# EAGLE design mug_marc_plane (EAGLE 5.11)
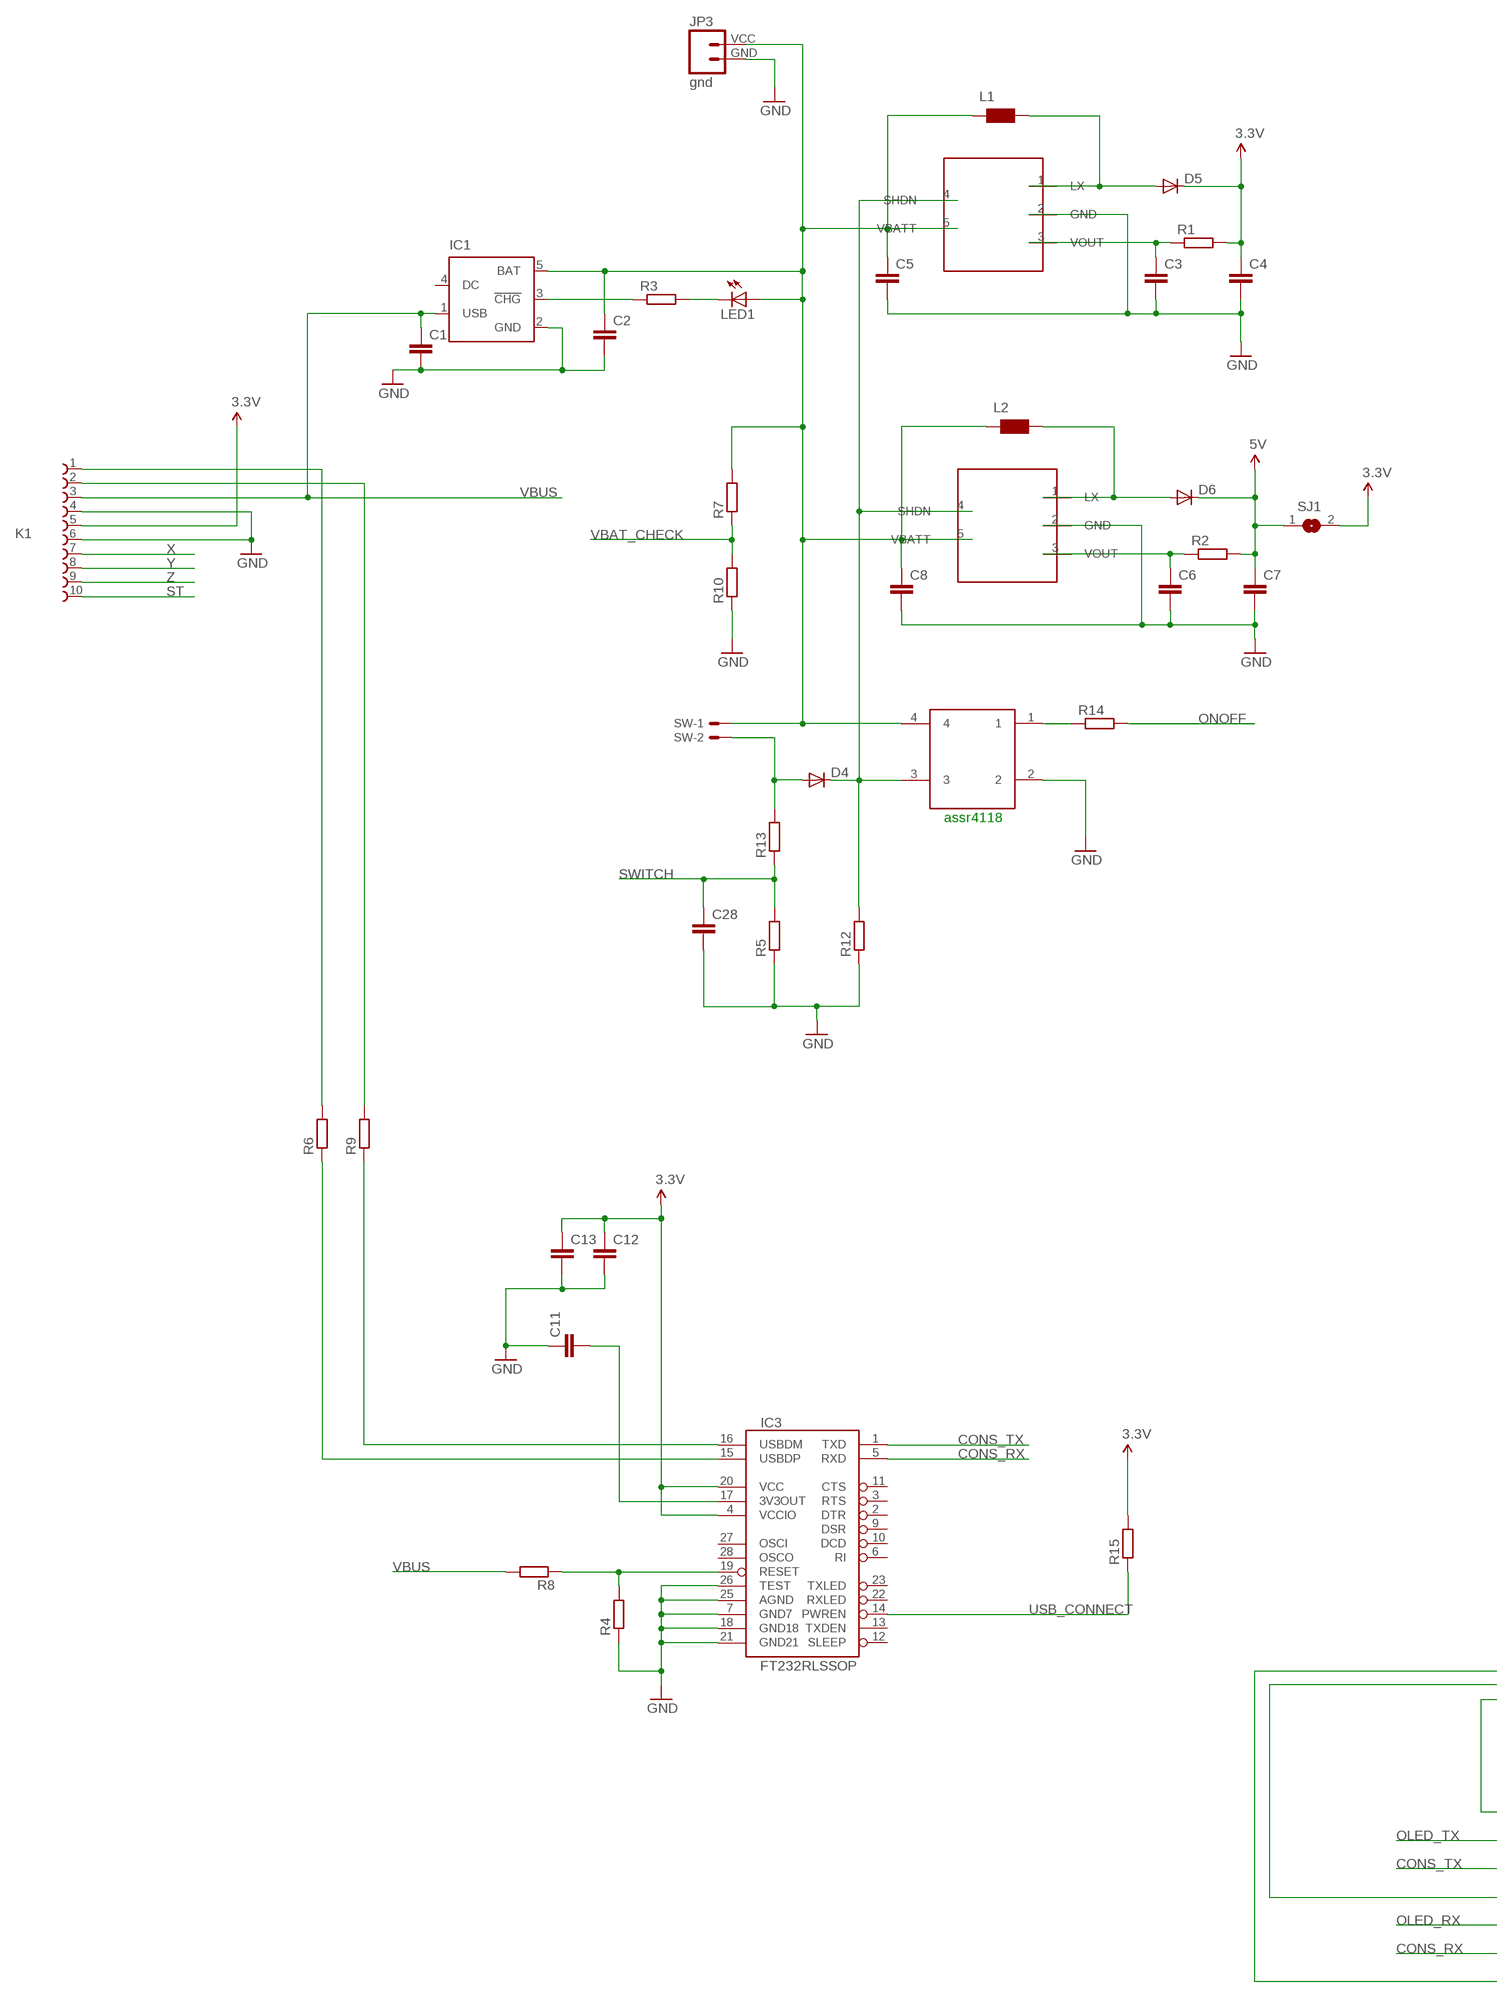
[diagram p0: schematic, sheet 1, part 1 of 2]
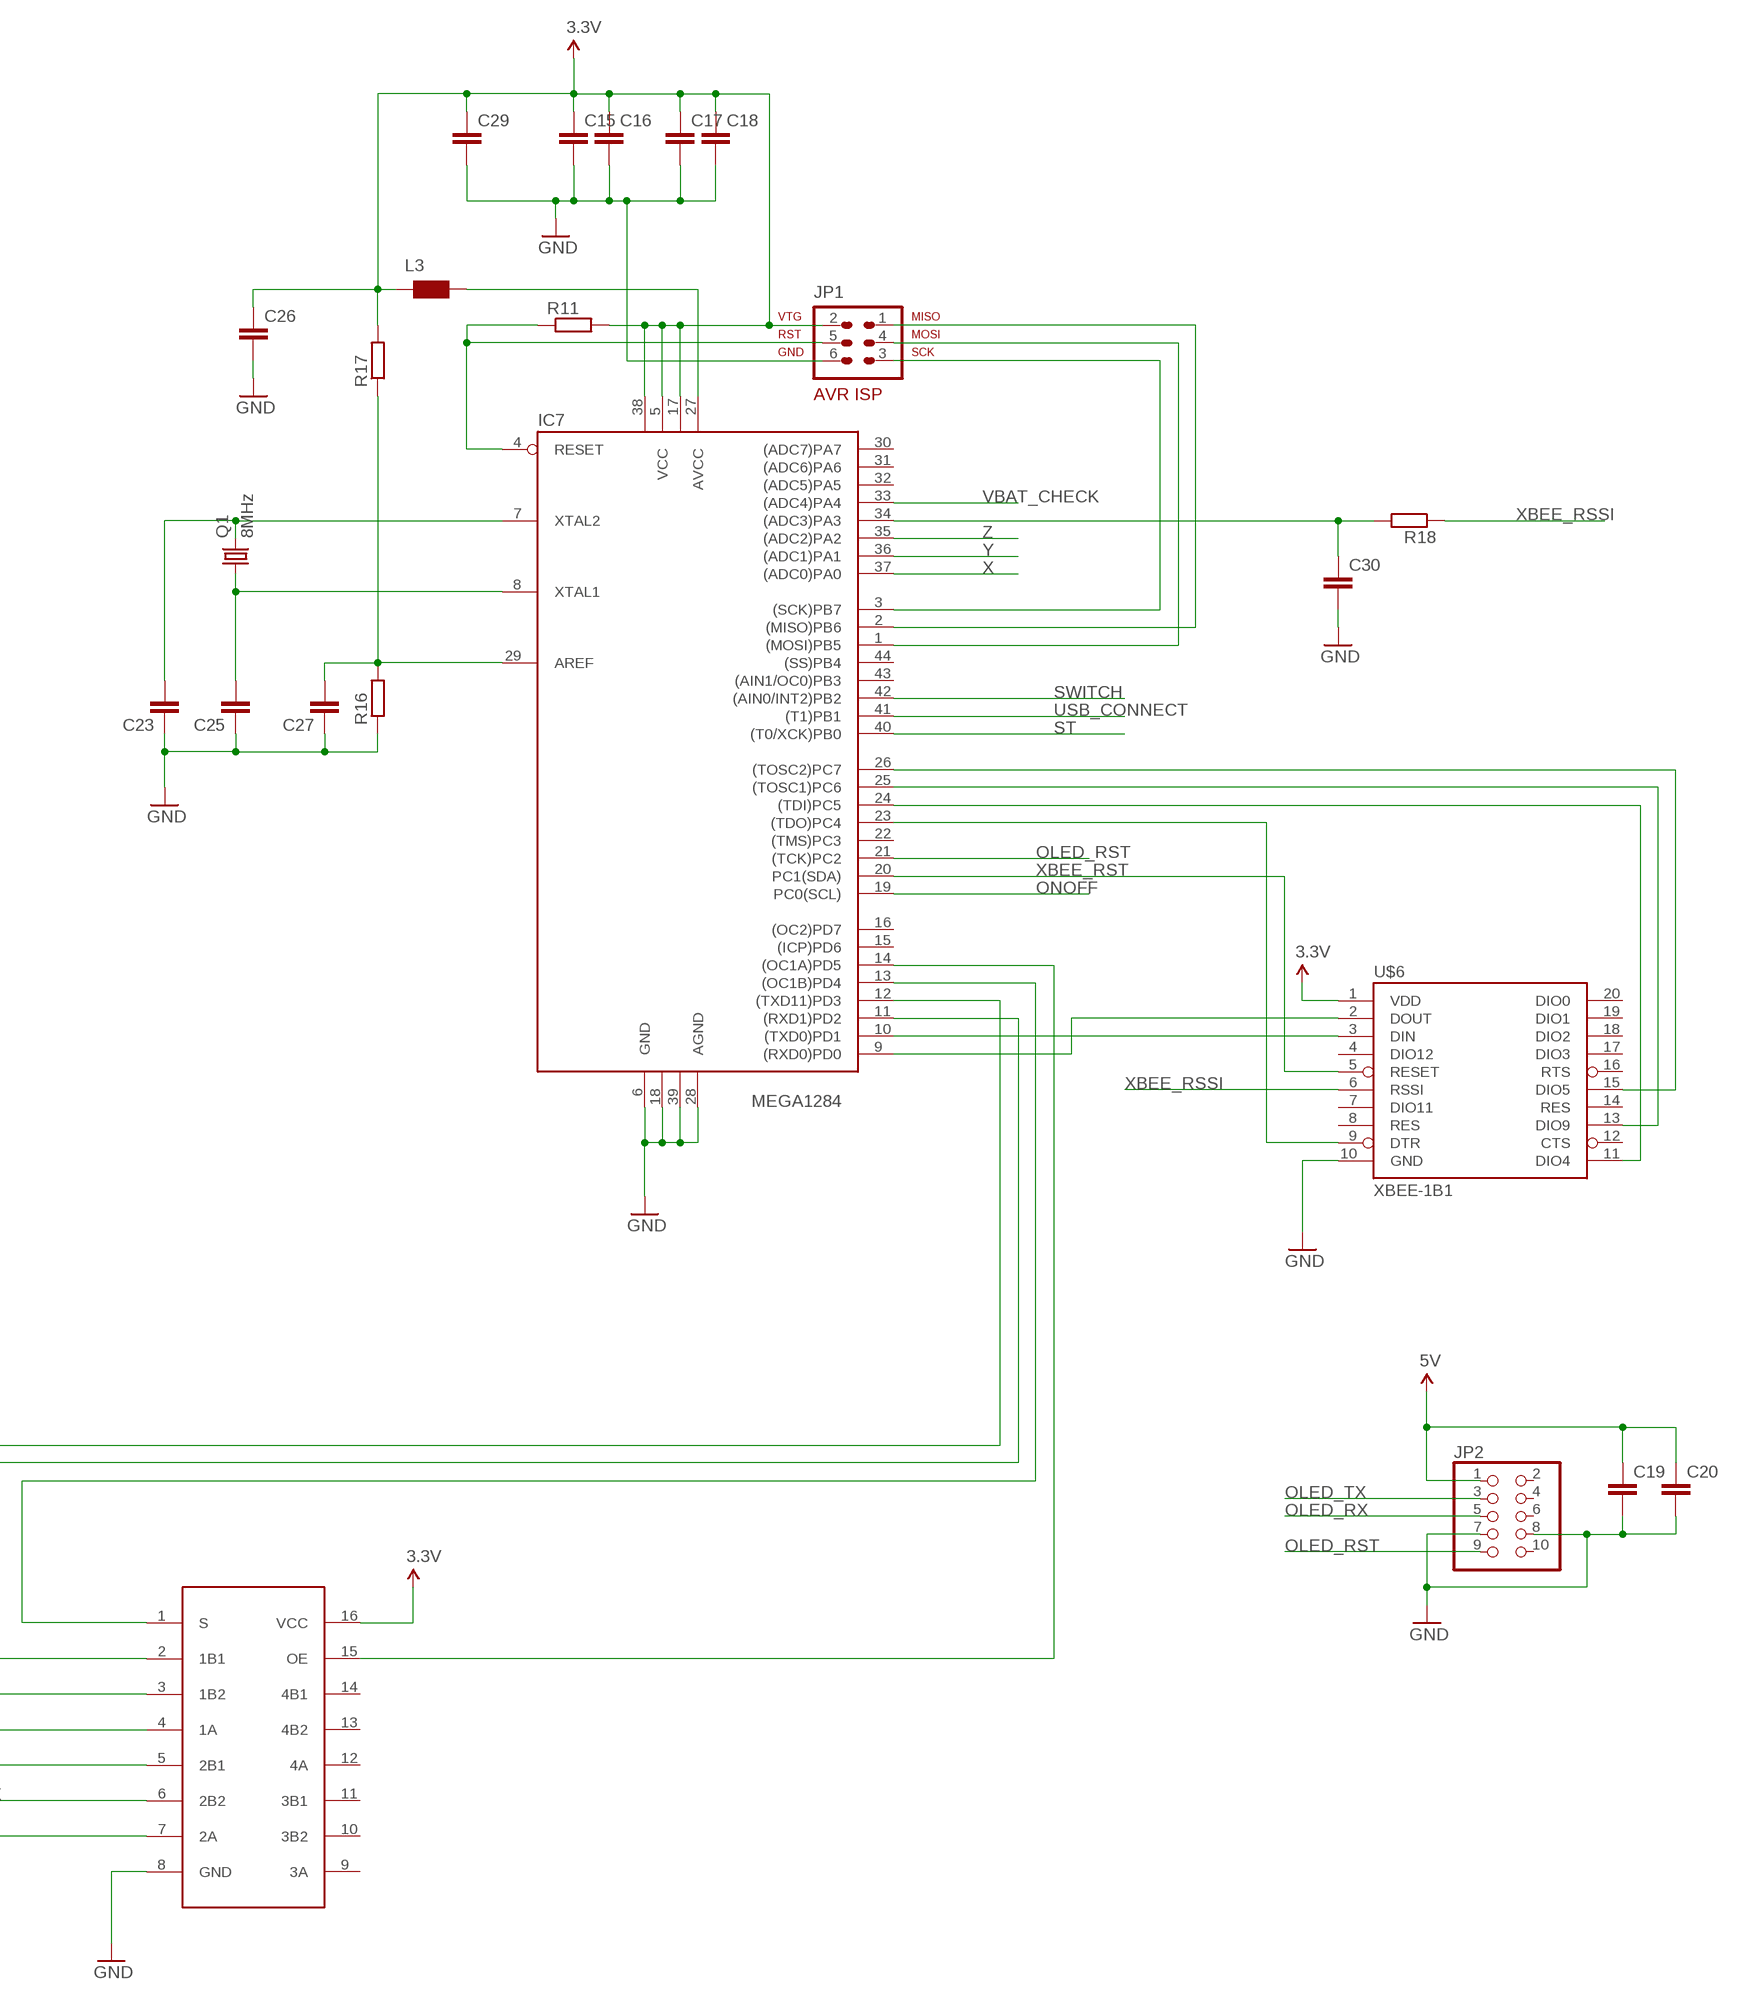
[diagram p1: schematic, sheet 1, part 2 of 2]

## Parts
C1  C-EUC0805  [C0805]
C2  C-EUC0805  [C0805]
C3  C-EUC0805  [C0805]
C4  C-EUC1210  [C1210]
C5  C-EUC1210  [C1210]
C6  C-EUC0805  [C0805]
C7  C-EUC1210  [C1210]
C8  C-EUC1210  [C1210]
C11  C-EUC0603  [C0603]
C12  C-EUC0805  [C0805]
C13  C-EUC0805  [C0805]
C15  C-EUC0805  [C0805]
C16  C-EUC0805  [C0805]
C17  C-EUC0805  [C0805]
C18  C-EUC0805  [C0805]
C19  C-EUC0805  [C0805]
C20  C-EUC0805  [C0805]
C23  C-EUC0603  [C0603]
C25  C-EUC0603  [C0603]
C26  C-EUC0805  [C0805]
C27  C-EUC0603  [C0603]
C28  C-EUC0805  [C0805]
C29  C-EUC0805  [C0805]
C30  C-EUC0805  [C0805]
D4  DIODE-DO214AC  [DO214AC]
D5  DIODE-DO214AC  [DO214AC]
D6  DIODE-DO214AC  [DO214AC]
IC1  MAX1555  [SOT23-5L]
IC3  FT232RLSSOP  [SSOP28DB]
IC4  ASSR  ASSR4118  [SO-6/4]
IC5  SP6641  [SOT23-5]
IC6  74XX3257  [SO16D]
IC7  MEGA1284  [TQFP44]
IC8  SP6641  [SOT23-5]
JP1  ISP  AVR-ISP-6  [AVR-ISP-6]
JP2  PINHD-2X5  [2X05]
JP3  gnd  M024UCON-15767  [S2B-PH-VERTICAL]
K1  68611014422  [68611014422]
L1  WE-TPC_L/LH  [WE-TPC_L/LH]
L2  WE-TPC_L/LH  [WE-TPC_L/LH]
L3  WE-TPC_L/LH  [WE-TPC_L/LH]
LED1  LED1206  [LED-1206]
Q1  8MHz  CRYSTALSMD  [HC49UP]
R1  R-EU_R0805  [R0805]
R2  R-EU_R0805  [R0805]
R3  R-EU_R0805  [R0805]
R4  R-EU_R0805  [R0805]
R5  R-EU_R0805  [R0805]
R6  R-EU_R0805  [R0805]
R7  R-EU_R0805  [R0805]
R8  R-EU_R0805  [R0805]
R9  R-EU_R0805  [R0805]
R10  R-EU_R0805  [R0805]
R11  R-EU_R0805  [R0805]
R12  R-EU_R0805  [R0805]
R13  R-EU_R0805  [R0805]
R14  R-EU_R0805  [R0805]
R15  R-EU_R0805  [R0805]
R16  R-EU_R0805  [R0805]
R17  R-EU_R0805  [R0805]
R18  R-EU_R0805  [R0805]
SJ1  SJW  [SJW]
SW  53398-02  [53398-02]
U$6  XBEE-1B1  [XBEE-1]

## Nets
5V: C7.1 C19.1 C20.1 D6.C JP2.1 R2.2 SJ1.1
CONS_RX: IC3.5(RXD) IC6.6(2B2)
CONS_TX: IC3.1(TXD) IC6.3(1B2)
GND: C1.2 C2.2 C3.2 C4.2 C5.2 C6.2 C7.2 C8.2 C11.1 C12.2 C13.2 C15.2 C16.2 C17.2 C18.2 C19.2 C20.2 C23.1 C25.1 C26.2 C27.1 C28.2 C29.2 C30.2 IC1.2(GND) IC3.7(GND7) IC3.18(GND18) IC3.21(GND21) IC3.25(AGND) IC3.26(TEST) IC4.2 IC5.2(GND) IC6.8(GND) IC7.6(GND) IC7.18(GND1) IC7.28(AGND) IC7.39(GND2) IC8.2(GND) JP1.6 JP2.7 JP2.8 JP3.GND K1.4 K1.6 R4.1 R5.1 R10.1 R12.1 R16.1 U$6.10(GND)
N$1: IC6.4(1A) IC7.11((RXD1)PD2)
N$2: LED1.C R3.2
N$3: D5.A IC5.1(LX) L1.1
N$4: IC7.4(RESET) JP1.5 R11.1
N$5: IC7.2((MISO)PB6) JP1.1
N$6: IC7.1((MOSI)PB5) JP1.4
N$7: IC7.3((SCK)PB7) JP1.3
N$9: C3.1 IC5.3(VOUT) R1.1
N$10: C2.1 C5.1 C8.1 IC1.5(BAT) IC4.4 IC5.5(VBATT) IC8.5(VBATT) JP3.VCC L1.2 L2.2 LED1.A R7.2 SW.1
N$11: D6.A IC8.1(LX) L2.1
N$12: C6.1 IC8.3(VOUT) R2.1
N$13: IC1.3(!CHG) R3.1
N$15: D4.A R13.2 SW.2
N$17: C11.2 IC3.17(3V3OUT)
N$18: IC7.9((RXD0)PD0) U$6.2(DOUT)
N$19: IC7.10((TXD0)PD1) U$6.3(DIN)
N$20: IC3.16(USBDM) R9.1
N$21: K1.2 R9.2
N$22: K1.1 R6.2
N$23: IC3.15(USBDP) R6.1
N$25: IC7.24((TDI)PC5) U$6.11(DIO4)
N$26: IC3.19(RESET) R4.2 R8.1
N$27: D4.C IC4.3 IC5.4(SHDN) IC8.4(SHDN) R12.2
N$28: C30.1 IC7.34((ADC3)PA3) R18.2
N$29: IC7.25((TOSC1)PC6) U$6.13(DIO9)
N$30: IC7.23((TDO)PC4) U$6.9(DTR)
N$31: IC7.26((TOSC2)PC7) U$6.15(DIO5)
N$33: IC4.1 R14.1
N$34: C25.2 IC7.8(XTAL1) Q1.1
N$36: IC6.7(2A) IC7.12((TXD11)PD3)
N$37: IC6.1(S) IC7.13((OC1B)PD4)
N$38: IC6.15(OE) IC7.14((OC1A)PD5)
N$39: IC7.27(AVCC) L3.1
N$40: C27.2 IC7.29(AREF) R16.2 R17.1
N$43: C23.2 IC7.7(XTAL2) Q1.2
N$45: C4.1 C12.1 C13.1 C15.1 C16.1 C17.1 C18.1 C26.1 C29.1 D5.C IC3.4(VCCIO) IC3.20(VCC) IC6.16(VCC) IC7.5(VCC) IC7.17(VCC1) IC7.38(VCC2) JP1.2 K1.5 L3.2 R1.2 R11.2 R15.2 R17.2 SJ1.2 U$6.1(VDD) ; supply symbol labelled 3.3V
OLED_RST: IC7.21((TCK)PC2) JP2.9
OLED_RX: IC6.5(2B1) JP2.5
OLED_TX: IC6.2(1B1) JP2.3
ONOFF: IC7.19(PC0(SCL)) R14.2
ST: IC7.40((T0/XCK)PB0) K1.10
SWITCH: C28.1 IC7.42((AIN0/INT2)PB2) R5.2 R13.1
USB_CONNECT: IC3.14(PWREN) IC7.41((T1)PB1) R15.1
VBAT_CHECK: IC7.33((ADC4)PA4) R7.1 R10.2
VBUS: C1.1 IC1.1(USB) K1.3 R8.2
X: IC7.37((ADC0)PA0) K1.7
XBEE_RSSI: R18.1 U$6.6(RSSI)
XBEE_RST: IC7.20(PC1(SDA)) U$6.5(RESET)
Y: IC7.36((ADC1)PA1) K1.8
Z: IC7.35((ADC2)PA2) K1.9
Unconnected: IC1.4(DC) IC3.2(DTR) IC3.3(RTS) IC3.6(RI) IC3.9(DSR) IC3.10(DCD) IC3.11(CTS) IC3.12(SLEEP) IC3.13(TXDEN) IC3.22(RXLED) IC3.23(TXLED) IC3.27(OSCI) IC3.28(OSCO) IC6.9(3A) IC6.10(3B2) IC6.11(3B1) IC6.12(4A) IC6.13(4B2) IC6.14(4B1) IC7.15((ICP)PD6) IC7.16((OC2)PD7) IC7.22((TMS)PC3) IC7.30((ADC7)PA7) IC7.31((ADC6)PA6) IC7.32((ADC5)PA5) IC7.43((AIN1/OC0)PB3) IC7.44((SS)PB4) JP2.2 JP2.4 JP2.6 JP2.10 U$6.4(DIO12) U$6.7(DIO11) U$6.8(RES) U$6.12(CTS) U$6.14(RES) U$6.16(RTS) U$6.17(DIO3) U$6.18(DIO2) U$6.19(DIO1) U$6.20(DIO0)

## Notes on the sheet
- assr4118

## Library data of the parts
C1-C8 C11-C13 C15-C20 C23 C25-C30 = rcl:C-EU: CAPACITOR, European symbol
D4-D6 = diode:DIODE-: DIODE
IC1 = maxim:MAX1555: Dual-Input USB/AC Adapter 1-Cell Li+ Battery Chargers Source: http://www.maxim-ic.com .. MAX1551-MAX1555.pdf
IC3 = SparkFun:FT232RL: USB UART FT232RL 4th Generation USB UART (USB <-> Serial) Controller. Spark Fun Electronics SKU : COM-00650
IC4 = stan_1:ASSR4118
IC5 IC8 = stan_1:SP6641
IC6 = stan_1:74XX3257
IC7 = stan_1:MEGA1284
JP1 = atmel-1:AVR-ISP-6: AVR ISP-6 Serial Programming Header
JP2 = pinhead:PINHD-2X5: PIN HEADER
JP3 = SparkFun2:M02: Header 2 Standard 2-pin 0.1" header. Use with straight break away headers (SKU : PRT-00116), right angle break away headers (PRT-00553), swiss pins (PRT-00743), machine pins (PRT-00117), and female headers (PRT-00115). Molex polarized connector foot print use with SKU : PRT-08233 with associated crimp pins and housings.
K1 = Wuerth_Elektronik_eiCan_03_ZIF_Connectors_Flat_Flexible_Cable:68611014422: WR-FPC 1.00mm SMT ZIF Horizontal Bottom Contact, 10 Pins
L1-L3 = wuerth-elektronik:WE-TPC: Shielded Tiny Power Inductor WE-TPC - Extremely flat power inductor - High current capability - High reliability and perfect soldering characteristics because of integrated soldering pad - magnetically shielded -- Portable power like PDA, digital camera, PCMICA-cards and displays -- DC/DC-converter -- Recommended for switching regulator IC's from Linear Technology, National Semiconductor, Texas Instruments and Fairchild Semiconductor
LED1 = SparkFun:LED: LEDs Standard schematic elements and footprints for 5mm, 3mm, 1206, and 0603 sized LEDs. 5mm - Spark Fun Electronics SKU : COM-00529 (and others)
Q1 = SparkFun:CRYSTAL: Crystals Various standard crystals. Proven footprints. Spark Fun Electronics SKU : COM-00534
R1-R18 = rcl:R-EU_: RESISTOR, European symbol
SJ1 = jumper:SJ: SMD solder JUMPER
SW = con-molex:53?-02: CONNECTOR wire to board 1.25 mm (.049 inch) pitch header
U$6 = SparkFun:XBEE-1

## Board
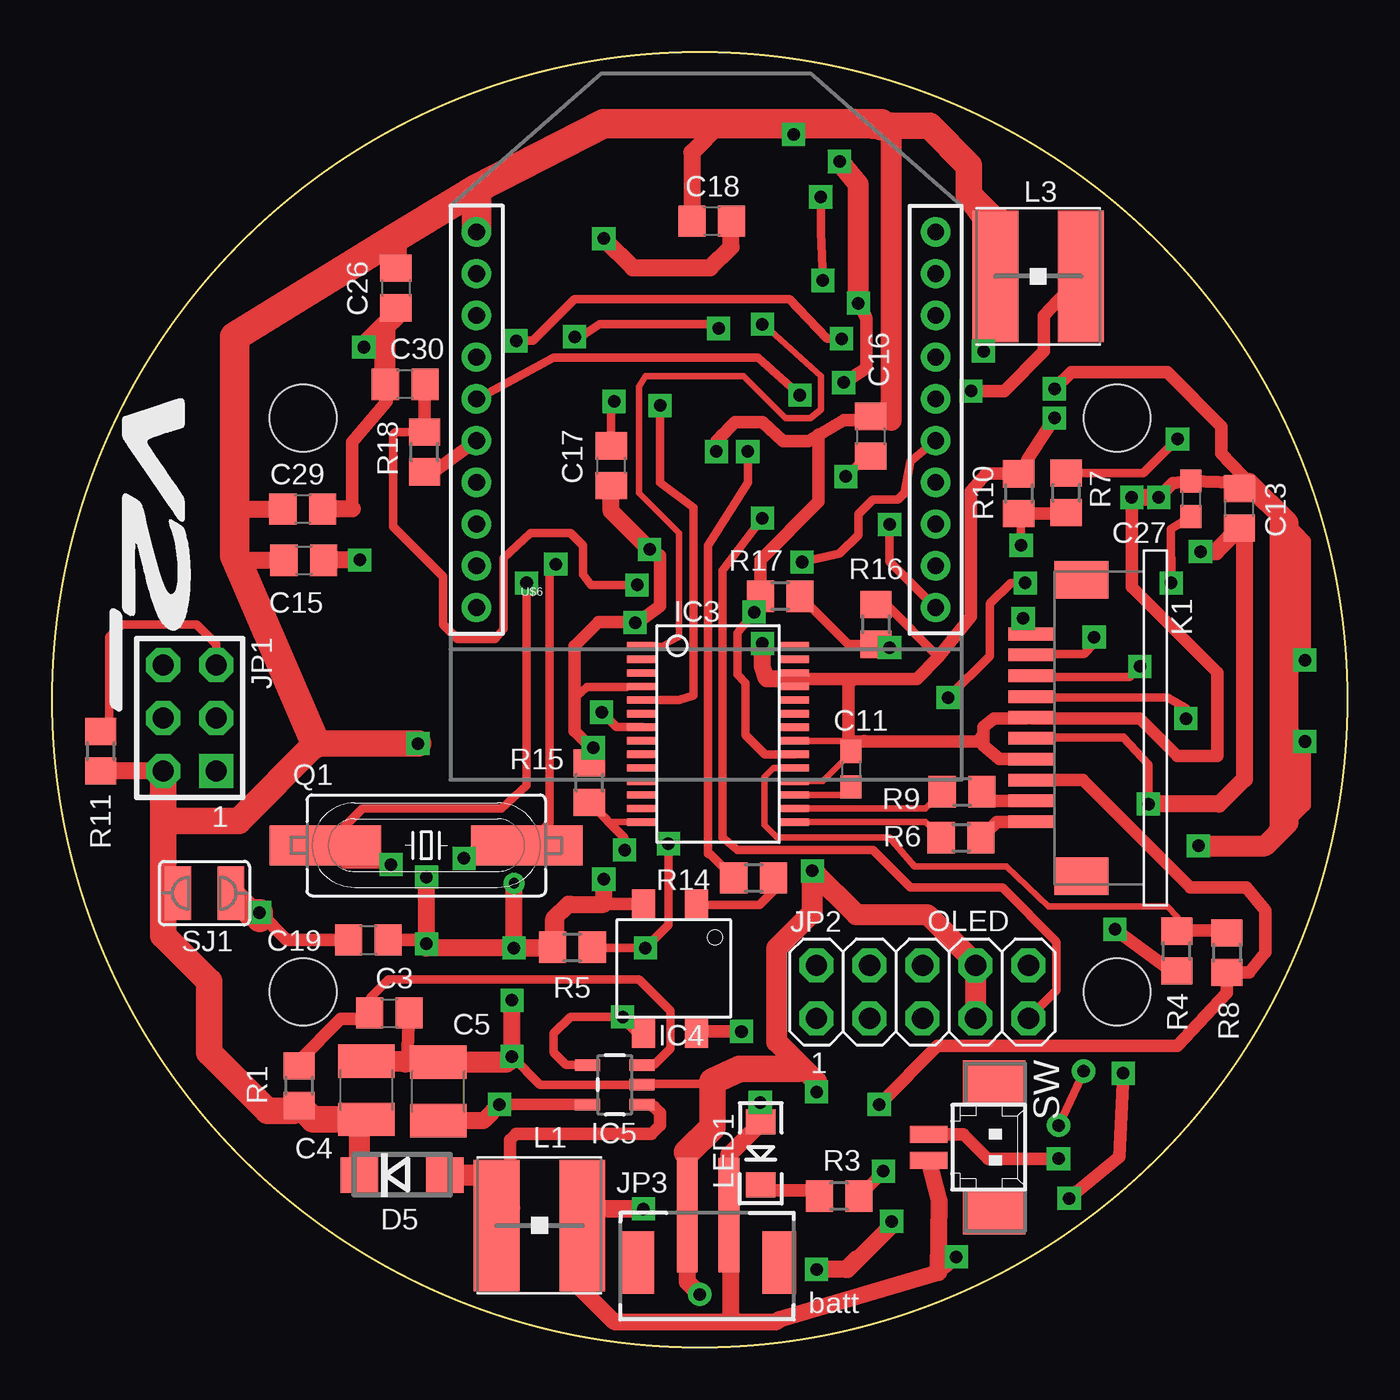
[diagram p2: board, top side]
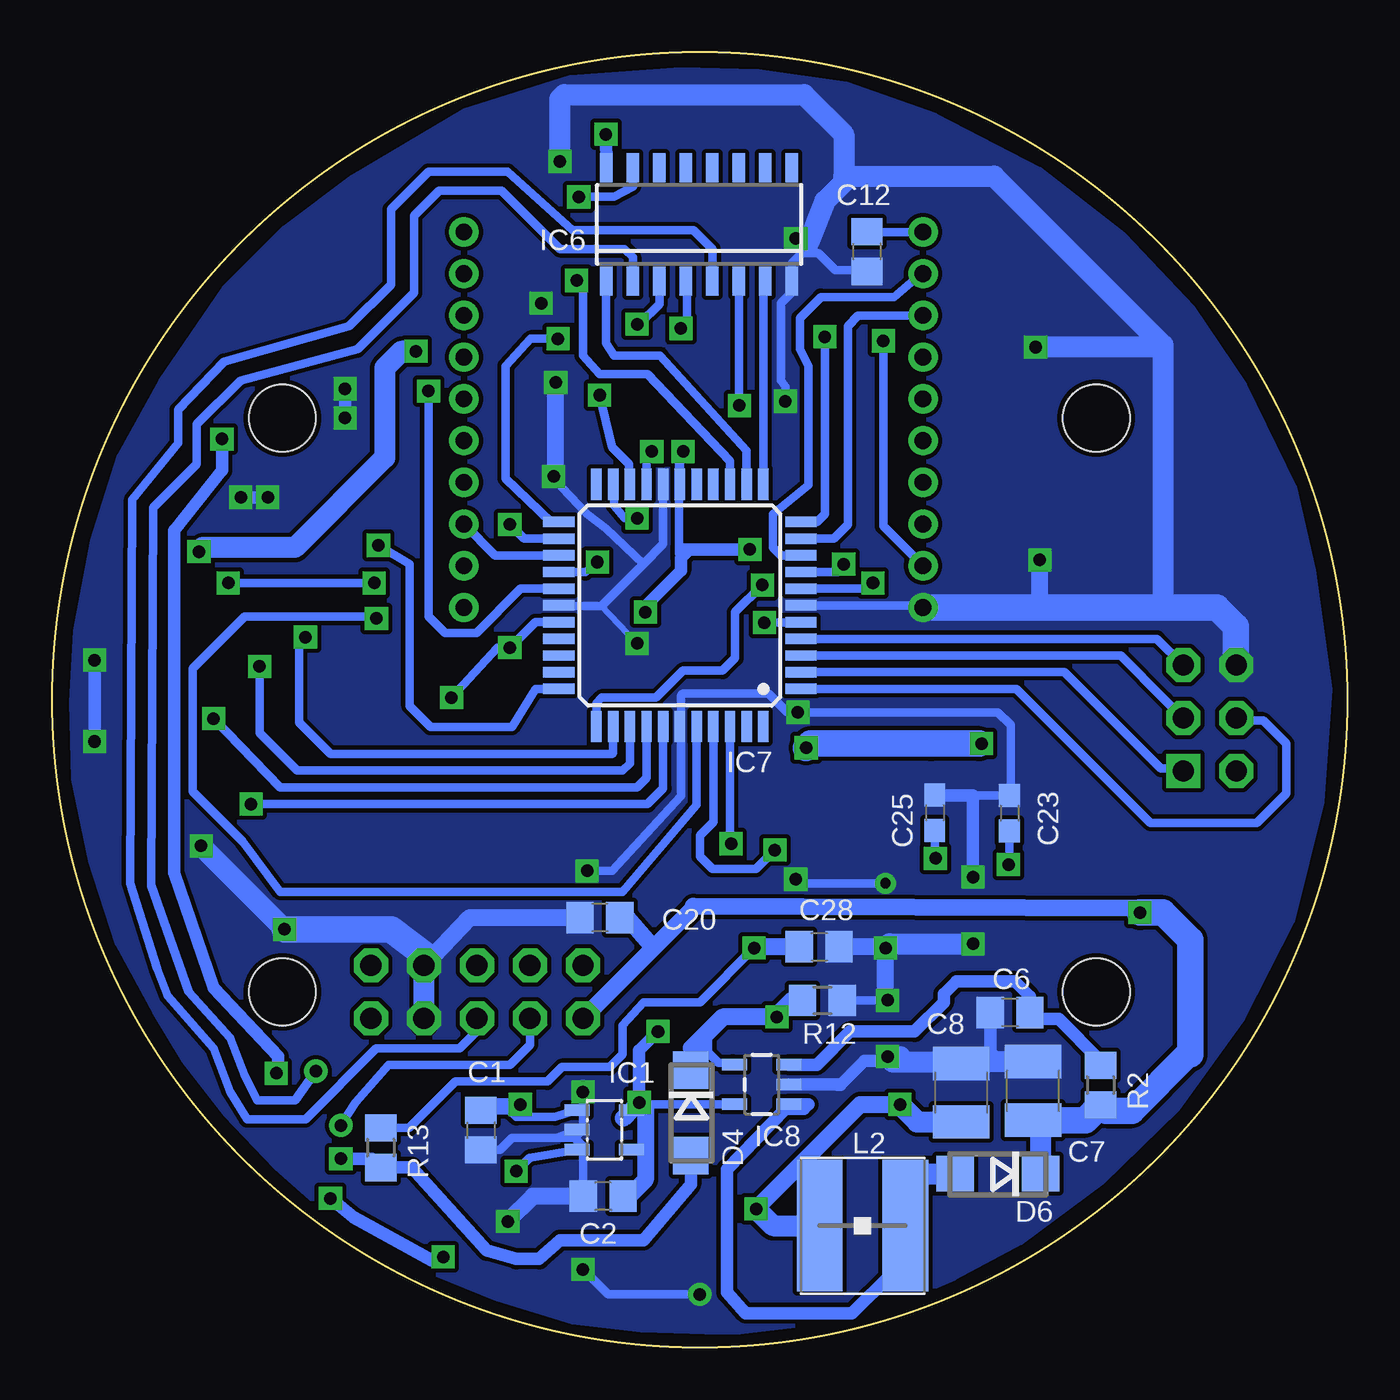
[diagram p3: board, bottom side, seen from below]

Size 62.07 x 62.07 mm. Coordinates in mm from the lower left corner, seen from the top.
Outline: circle at 31.04,31.04 radius 31.04
Copper layers (1*16): Top 0.035mm / dielectric 1.5mm / Bottom 0.035mm
Design rules "V2_ *": minimum track width 8mil, minimum drill 20mil, track to track 8mil, track to pad 8mil, pad to pad 8mil, via to via 8mil, smd to smd 0mil, copper to edge 10mil, drill to drill 8mil, minimum pad ring 12mil, minimum via ring 10mil, stop-mask expansion 4mil, vias tented up to drill 25mil, thermal gap 10mil
Holes 3.2 mm at 12.04,17.04 51.04,17.04 51.04,44.54 12.04,44.54

### Footprints (pad centres in the part's own frame; a part is rotated, then mirrored left to right if it is on the bottom)
C0805 = smd 1.3 x 1.5: 1 -0.95,0; 2 0.95,0
C1210 = smd 1.6 x 2.7: 1 -1.4,0; 2 1.4,0
C0603 = smd 1.1 x 1: 1 -0.85,0; 2 0.85,0
DO214AC = smd 1.8 x 1.7: A 2.05,0; C -2.05,0
SOT23-5L = smd 0.55 x 1.2: 1 -0.95,-1.3; 2 0,-1.3; 3 0.95,-1.3; 4 0.95,1.3; 5 -0.95,1.3
SSOP28DB = smd 0.348 x 1.397: 1 -4.225,-3.656; 2 -3.575,-3.656; 3 -2.925,-3.656; 4 -2.275,-3.656; 5 -1.625,-3.656; 6 -0.975,-3.656; 7 -0.325,-3.656; 8 0.325,-3.656; 9 0.975,-3.656; 10 1.625,-3.656; 11 2.275,-3.656; 12 2.925,-3.656; 13 3.575,-3.656; 14 4.225,-3.656; 15 4.225,3.656; 16 3.575,3.656; 17 2.925,3.656; 18 2.275,3.656; 19 1.625,3.656; 20 0.975,3.656; 21 0.325,3.656; 22 -0.325,3.656; 23 -0.975,3.656; 24 -1.625,3.656; 25 -2.275,3.656; 26 -2.925,3.656; 27 -3.575,3.656; 28 -4.225,3.656
SO-6/4 = smd 1.1 x 1.4: 1 -1.27,-3.1; 2 1.27,-3.1; 3 1.27,3.1; 4 -1.27,3.1
SOT23-5 = smd 0.55 x 1.2: 1 -0.95,-1.3; 2 0,-1.3; 3 0.95,-1.3; 4 0.95,1.3; 5 -0.95,1.3
SO16D = smd 0.6 x 1.4: 1 -4.445,-2.715; 2 -3.175,-2.715; 3 -1.905,-2.715; 4 -0.635,-2.715; 5 0.635,-2.715; 6 1.905,-2.715; 7 3.175,-2.715; 8 4.445,-2.715; 9 4.445,2.715; 10 3.175,2.715; 11 1.905,2.715; 12 0.635,2.715; 13 -0.635,2.715; 14 -1.905,2.715; 15 -3.175,2.715; 16 -4.445,2.715
TQFP44 = smd 1.5 x 0.5: 1 -5.8,4; 2 -5.8,3.2; 3 -5.8,2.4; 4 -5.8,1.6; 5 -5.8,0.8; 6 -5.8,0; 7 -5.8,-0.8; 8 -5.8,-1.6; 9 -5.8,-2.4; 10 -5.8,-3.2; 11 -5.8,-4; 23 5.8,-4; 24 5.8,-3.2; 25 5.8,-2.4; 26 5.8,-1.6; 27 5.8,-0.8; 28 5.8,0; 29 5.8,0.8; 30 5.8,1.6; 31 5.8,2.4; 32 5.8,3.2; 33 5.8,4 | smd 0.5 x 1.5: 12 -4,-5.8; 13 -3.2,-5.8; 14 -2.4,-5.8; 15 -1.6,-5.8; 16 -0.8,-5.8; 17 0,-5.8; 18 0.8,-5.8; 19 1.6,-5.8; 20 2.4,-5.8; 21 3.2,-5.8; 22 4,-5.8; 34 4,5.8; 35 3.2,5.8; 36 2.4,5.8; 37 1.6,5.8; 38 0.8,5.8; 39 0,5.8; 40 -0.8,5.8; 41 -1.6,5.8; 42 -2.4,5.8; 43 -3.2,5.8; 44 -4,5.8
AVR-ISP-6 = drill 1.016 square: 1 -2.54,-1.27 | drill 1.016 octagon: 2 -2.54,1.27; 3 0,-1.27; 4 0,1.27; 5 2.54,-1.27; 6 2.54,1.27
2X05 = drill 1.016 octagon: 1 -5.08,-1.27; 2 -5.08,1.27; 3 -2.54,-1.27; 4 -2.54,1.27; 5 0,-1.27; 6 0,1.27; 7 2.54,-1.27; 8 2.54,1.27; 9 5.08,-1.27; 10 5.08,1.27
S2B-PH-VERTICAL = smd 1 x 5.5: GND 1,-2; VCC -1,-2 | smd 1.6 x 3: P$1 -3.4,0.27; P$2 3.4,0.27
68611014422 = smd 0.6 x 2.2: 1 -7.5,1.1; 2 -6.5,1.1; 3 -5.5,1.1; 4 -4.5,1.1; 5 -3.5,1.1; 6 -2.5,1.1; 7 -1.5,1.1; 8 -0.5,1.1; 9 0.5,1.1; 10 1.5,1.1 | smd 1.8 x 2.6: Z1 -10.1,-1.3; Z2 4.1,-1.3
WE-TPC_L/LH = smd 2.2 x 6.3: 1 -2.05,0; 2 2.05,0
LED-1206 = smd 1.2 x 1.4: A -1.5,0; C 1.5,0
HC49UP = smd 5.334 x 1.93: 1 -4.826,0; 2 4.826,0
R0805 = smd 1.3 x 1.5: 1 -0.95,0; 2 0.95,0
SJW = smd 1.27 x 2.54: 1 -1.27,0; 2 1.27,0
53398-02 = smd 0.8 x 1.8: 1 0.625,-2.5; 2 -0.625,-2.5 | smd 2.1 x 3: S1 3.125,0.625; S2 -3.125,0.625
XBEE-1 = drill 0.8 round: 1 -11,20; 2 -11,18; 3 -11,16; 4 -11,14; 5 -11,12; 6 -11,10; 7 -11,8; 8 -11,6; 9 -11,4; 10 -11,2; 11 11,2; 12 11,4; 13 11,6; 14 11,8; 15 11,10; 16 11,12; 17 11,14; 18 11,16; 19 11,18; 20 11,20

### Placement (x,y rotation side)
C1  41.53,10.42 270 bottom
C2  35.67,7.25 180 bottom
C3  16.16,16.03 0 top
C4  15.07,12.33 90 top
C5  18.51,12.27 90 top
C6  16.17,16.05 180 bottom
C7  15.07,12.29 90 bottom
C8  18.51,12.21 90 bottom
C11  38.28,27.72 270 top
C12  23.03,52.52 270 bottom
C13  56.9,40.21 90 top
C15  12.06,37.73 0 top
C16  39.23,43.67 270 top
C17  26.8,42.26 90 top
C18  31.61,53.98 0 top
C19  15.16,19.53 0 top
C20  35.82,20.6 180 bottom
C23  16.2,25.61 270 bottom
C25  19.78,25.62 270 bottom
C26  16.48,50.77 270 top
C27  54.58,40.67 270 top
C28  25.32,19.2 0 bottom
C29  12.01,40.18 0 top
C30  16.92,46.15 180 top
D4  31.46,11.25 270 bottom
D5  16.78,8.26 0 top
D6  16.75,8.32 180 bottom
IC1  35.61,10.43 270 bottom
IC3  31.92,29.4 270 top
IC4  29.62,18.16 180 top
IC5  26.97,12.59 90 top
IC6  31.07,53.82 0 bottom
IC7  31.99,35.56 180 bottom
IC8  28.07,12.6 90 bottom
JP1  6.6,30.16 90 top
JP2  41.72,17.04 0 top
JP3  31.44,4.34 180 top
K1  48.03,32.69 90 top
L1  23.36,5.85 0 top
L2  23.24,5.83 180 bottom
L3  47.26,51.33 180 top
LED1  33.96,9.3 270 top
Q1  17.93,24.06 180 top
R1  11.84,12.55 270 top
R2  11.83,12.57 270 bottom
R3  37.72,7.25 180 top
R4  53.9,19 90 top
R5  24.94,19.18 0 top
R6  43.56,24.43 0 top
R7  48.6,40.96 90 top
R8  56.3,18.92 270 top
R9  43.61,26.63 0 top
R10  46.33,40.92 270 top
R11  2.33,28.57 270 top
R12  25.16,16.63 180 bottom
R13  46.33,9.57 270 bottom
R14  33.62,22.5 180 top
R15  25.75,27.06 90 top
R16  39.48,34.65 270 top
R17  34.9,36 180 top
R18  17.85,42.91 90 top
SJ1  7.3,21.77 180 top
SW  44.52,9.59 270 top
U$4  [V2_LOGO_L]  2.54,45.94 270 top
U$6  31.34,33.46 0 top

### Tracks (layer width: path | path; a pad name or v marks a point on that pad's centre or on a via)
5V  (via drill 0.6)
  Top 0.61: C19.1 11.25,19.53 v9.94,20.84
  Top 1.27: 9.94,20.54 v9.94,20.84 9.5,20.84 SJ1.1
  Bottom 0.813: v9.94,20.84 10.14,21.04 31.34,21.14 31.34,21.07 33.25,19.15 | 33.25,19.15 JP2.1 | C20.1 34.67,20.77 33.25,19.15
  Bottom 1.016: D6.C 14.7,10.52 C7.1
  Bottom 1.27: C7.1 12.56,10.89 R2.2 11.55,11.34 10.34,11.34 7.64,14.04 7.54,14.04 7.54,19.54 8.84,20.84 v9.94,20.84
CONS_RX  (via drill 0.6)
  Top 0.305: 29.14,31.04 28.28,31.04 IC3.5
  Top 0.406: v29.14,45.14 29.14,41.44 30.74,40.24 30.74,31.24 30.04,31.04 29.14,31.04
  Bottom 0.406: IC6.6 29.16,45.76 v29.14,45.14
CONS_TX  (via drill 0.6)
  Top 0.305: IC3.1 29.22,33.62 30.04,34.04 30.04,39.04 28.14,40.94 28.14,46.04 28.44,46.54 33.14,46.54 35.14,44.54 36.34,44.54 36.84,44.94 36.84,46.54 34.44,48.74 v34.04,49.04
  Bottom 0.406: IC6.3 32.97,50 33.94,49.04 34.14,49.24 v34.04,49.04
GND  (via drill 0.5 pad 0.25, 0.6)
  Top 0.305: 44.64,29.14 44.57,29.07 | IC3.25 35.21,32.04 35.14,32.04 35.42,32.32 IC3.26 | 37.17,29.07 IC3.21 38.94,29.07 39.4,29.07 39.44,29.04 | C11.1 38.17,28.37 36.94,27.14 35.59,27.14 IC3.18
  Top 0.406: v22.04,13.94 23.39,12.59 IC5.2 28.32,12.64 31.84,12.64 32.64,13.44 36.04,13.44 36.64,12.84 v36.64,12.24 | IC3.7 27.05,29.72 v26.34,30.44 | C16.2 39.02,42.72 v38.04,41.74 | R16.1 39.98,35.6 42.49,33.09 | C17.2 26.8,45.1 v26.94,45.34 | 34.74,14.64 35.64,13.74 35.75,13.74 | v22.14,19.14 23.74,19.14 23.94,19.34 23.94,20.34 24.84,21.24 26.34,21.24 26.44,21.34
  Top 0.61: C3.2 17.01,13.76 16.92,13.67 | IC4.2 24.86,21.26 24.84,21.24 24.24,20.64 24.24,19.43 R5.1 | K1.4 45.39,28.19 44.64,28.84 44.64,29.14 44.64,29.34 | R10.1 44.77,41.87 44.04,41.04 44.04,35.04 42.49,33.09 41.44,32.04 38.44,32.04 | 38.44,32.04 35.14,32.04 | 38.17,29.24 38.17,28.37 | 38.17,29.24 38.17,31.77 38.44,32.04 | 39.44,29.04 38.37,29.04 38.17,29.24 | 44.64,29.34 44.64,29.74 45.14,30.14 46.68,30.14 K1.6 46.98,30.14 52.14,30.14 53.94,28.34 55.84,28.34 55.84,32.34 51.74,36.44 v51.74,40.74 | 44.64,29.34 44.34,29.04 38.97,29.04 38.94,29.07 | R4.1 53.63,18.05 v50.94,20.04 | C13.2 57.34,41.42 C27.1 53.72,41.42 v53.04,40.74 | C19.2 17.75,19.53 v17.94,19.34 | v37.94,46.24 39.04,46.94 39.04,49.34 v38.64,50.04 | v54.94,24.04 58.24,24.04 58.34,24.26 | 58.34,24.26 58.64,24.94 58.64,40.04 | v48.04,45.94 48.84,46.74 53.44,46.74 56.04,44.14 56.04,42.84 60.04,38.64 v60.04,32.94 60.04,32.74 | v48.04,44.54 46.74,42.54 46.34,41.84 | 14.38,40.18 14.38,43.38 16.04,45.34 16.04,46.08 C30.2 | v60.04,29.04 60.04,25.96 58.34,24.26
  Top 0.813: 35.75,13.74 35.74,13.34 | v22.04,13.94 v22.04,16.64 | R5.1 22.18,19.18 v22.14,19.14 | v34.04,33.74 34.04,32.64 34.24,32.04 35.14,32.04 | 14.38,40.18 C29.2 | C18.2 32.56,53.96 32.54,53.94 32.54,52.74 31.54,51.74 27.84,51.74 v26.44,53.14 | C15.2 v14.73,37.73 v14.74,37.74 | v40.24,6.04 40.24,5.84 38.14,3.74 38.04,3.74 | v53.04,40.74 v51.74,40.74 | 30.44,8.94 JP3.GND | JP3.GND 30.44,5.94 | v31.04,2.54 30.44,3.14 JP3.GND | 38.04,3.74 v36.64,3.74 | 38.04,3.74 38.54,4.24 | v22.14,19.14 17.94,19.14 v17.94,19.34 v17.94,22.54 17.94,22.64 | v22.14,19.14 v22.14,22.24 | v26.44,22.44 26.44,21.34 26.44,21.24 24.84,21.24 24.74,21.24 24.04,20.54 24.04,19.14 v22.14,19.14
  Top 1.016: C4.2 16.92,13.67 18.47,13.63 C5.2 21.77,13.67 v22.04,13.94 | 15.94,48.94 16.48,49.48 C26.2 | 15.94,48.94 15.94,45.98 C30.2 | v14.94,47.94 15.94,48.94 | v37.74,56.84 38.64,55.74 v38.64,50.04 | JP2.7 JP2.8 44.26,18.42 41.94,20.74 38.54,20.74 v36.44,22.84 36.44,20.84 34.74,19.14 34.74,14.64 36.64,12.74 v36.64,12.24 | v54.94,24.04 58.14,24.04 59.24,25.14 59.24,39.52 57.34,41.42 | 30.44,9.34 30.44,8.94
  Top 1.27: 30.44,9.34 31.64,10.54 31.64,12.74 32.94,13.34 35.74,13.34
  Bottom 0.305: C12.2 24.57,51.57 25.84,52.94 | IC7.28 35.76,35.56 v34.04,33.74
  Bottom 0.406: 37.04,10.04 37.9,10.04 IC1.2 37.92,10.04 40.04,10.04 40.61,9.47 C1.2 | 37.04,10.04 36.64,10.44 v36.64,12.24 | C2.2 36.64,7.27 36.64,9.64 37.04,10.04 | R12.1 v22.05,16.63 v22.04,16.64 | C12.2 23.1,51.64 24.54,51.64 25.34,52.44 26.14,52.44 26.62,51.95 IC6.8 26.54,51.02 26.54,50.64 27.14,50.04 27.14,46.34 26.94,46.04 v26.94,45.34 | IC7.18 32.79,38.49 33.74,37.54 | 33.74,37.54 35.74,35.54 37.47,35.54 IC7.28 | C25.1 C23.1 16.14,26.52 16.14,29.84 16.74,30.44 v26.34,30.44 26.84,30.44 27.74,31.34 31.84,31.34 31.94,31.24 31.94,29.81 | 31.94,29.81 IC7.39 | v38.04,41.74 38.04,41.64 36.44,39.94 35.54,39.24 33.74,37.54 | 31.94,29.81 31.94,26.44 35.24,22.84 v36.44,22.84 | IC7.6 20.34,35.56 U$6.10 | C5.2 C8.2 | v36.64,3.74 35.44,2.54 v31.04,2.54 | v22.14,22.24 26.54,22.24 v26.44,22.44
  Bottom 0.61: C6.2 17.12,14.14 17.02,14.04 18.13,14.04 C5.2 | IC8.2 24.45,12.6 24.44,12.59 24.29,12.59 23.14,13.74 22.24,13.74 v22.04,13.94 | C25.1 17.96,26.46 17.94,26.44 v17.94,22.54 | v53.04,40.74 v51.74,40.74 | v48.04,45.94 v48.04,44.54 | v60.04,29.04 v60.04,32.94
  Bottom 0.813: v22.04,16.64 22.14,16.74 v22.14,19.14 22.2,19.2 C28.2 | v26.44,53.14 26.14,53.14 25.84,52.94 | v37.94,46.24 37.94,41.84 v38.04,41.74 | v14.74,37.74 14.74,35.76 14.44,35.46 | C2.2 39.03,7.25 v40.24,6.04 | C20.2 42.07,20.6 JP2.8
  Bottom 1.016: 21.44,13.94 v22.04,13.94 21.77,13.67 C5.2 18.49,13.69 C7.2 | v36.64,12.24 36.64,12.34 | v17.94,19.34 21.94,19.34 v22.14,19.14 | 25.84,52.94 25.04,54.94 23.84,56.14 | 23.84,56.14 16.94,56.14 8.84,48.04 8.84,47.74 | 23.84,56.14 24.14,56.14 24.14,58.14 26.04,60.04 37.54,60.04 37.74,59.84 v37.74,56.84 | 8.84,47.74 8.84,35.76 9.14,35.46 | v14.94,47.94 9.04,47.94 8.84,47.74 | v50.94,20.04 v54.94,24.04
  Bottom 1.27: U$6.10 14.44,35.46 9.14,35.46 6.26,35.46 5.34,34.54 JP1.6 | JP2.8 44.16,18.76 45.84,20.04 v50.94,20.04
  pour Bottom (no thermals): 29.14,0.74 23.24,1.44 18.84,3.34 15.64,5.04 11.74,7.94 8.14,11.44 5.04,15.74 2.64,20.44 1.24,26.14 0.84,31.54 1.64,37.24 2.54,41.24 4.94,46.14 7.44,49.84 10.74,53.34 14.74,56.44 19.74,59.04 24.04,60.54 28.24,61.14 31.94,61.24 37.24,60.84 42.34,59.24 47.74,56.04 50.94,53.64 53.84,50.74 56.84,46.34 58.84,42.74 60.14,38.64 60.94,34.34 61.14,30.94 61.04,27.24 60.24,23.34 58.94,19.34 57.14,16.04 55.74,13.74 53.74,11.14 51.34,8.64 48.64,6.24 44.44,3.84 40.74,2.34 37.14,1.24 33.84,0.84 30.74,0.74
N$1  (via drill 0.6)
  Top 0.406: v25.04,48.44 25.34,48.44 26.24,49.04 31.84,49.04 v31.94,48.84
  Bottom 0.406: IC7.11 25.42,39.56 25.04,39.94 v25.04,48.44 | v31.94,48.84 31.64,49.14 31.64,51.04 IC6.4
N$2
  Top 0.61: R3.2 36.48,7.54 34.44,7.54 34.18,7.8 LED1.C
N$3
  Top 0.406: IC5.1 28.74,11.64 28.84,11.54
  Top 0.61: L1.1 22.14,6.68 | 28.84,11.54 29.14,11.24 29.14,10.64 28.74,10.24 22.24,10.24 21.94,9.94 21.94,7.54 21.14,6.74
  Top 1.016: D5.A 21.12,8.26 21.14,8.24 21.14,6.74 21.14,6.02 L1.1
N$4
  Top 0.406: JP1.5 7.87,33.71 6.94,34.64 3.34,34.64 2.74,34.04 2.74,29.93 R11.1
  Bottom 0.406: IC7.4 9.13,33.96 JP1.5
N$5
  Bottom 0.406: IC7.2 13.56,32.36 8.94,27.74 7.99,27.74 JP1.1
N$6
  Bottom 0.406: IC7.1 15.86,31.56 9.44,25.14 4.34,25.14 2.94,26.54 2.94,28.94 4.04,30.04 5.21,30.04 JP1.4
N$7
  Bottom 0.406: IC7.3 10.86,33.16 8.74,31.04 8.75,31.04 JP1.3
N$8
  Bottom 1.016: 44.24,15.54 44.24,18.44
N$9
  Top 0.406: IC5.3 28.84,13.54 29.64,14.34 29.64,16.14 28.14,17.64 16.14,17.64 15.24,16.74 15.24,16.16 C3.1
  Top 0.61: R1.1 11.84,13.74 13.84,15.74 14.82,15.74 C3.1
N$10  (via drill 0.6)
  Top 0.406: R7.2 52.31,41.91 v53.94,43.54
  Top 0.55: v21.44,11.64 IC5.5
  Top 0.61: v51.34,13.14 51.14,9.14 v48.74,7.14 | v33.04,15.14 30.97,15.14 IC4.4 | v43.34,4.34 42.94,3.94 42.49,3.59
  Top 0.813: L1.2 26.2,6.64 v28.34,6.64 26.34,6.64 26.24,6.74 26.2,6.74 L2.2 25.29,2.89 26.94,1.24 32.54,1.24 | C5.1 20.67,10.87 v21.44,11.64 | SW.1 42.52,7.02 42.49,3.59 34.84,1.34 34.74,1.24 32.54,1.24 | LED1.A 33.96,11.72 v33.94,11.74 33.94,10.74 32.44,9.24 JP3.VCC 32.34,5.94 32.54,5.74 32.54,1.24
  Bottom 0.406: IC8.5 29.58,11.64 33.44,11.64 v33.94,11.74 | v33.94,11.74 34.04,11.74 34.04,11.84 v33.94,11.74
  Bottom 0.61: v53.94,43.54 53.94,42.04 56.24,39.14 56.24,22.74 54.34,17.24 51.24,13.94 51.24,12.94 v51.34,13.14 | v48.74,7.14 47.64,6.24 43.84,4.14 v43.34,4.34 | v33.94,11.74 33.94,14.24 v33.04,15.14
  Bottom 0.813: v21.44,11.64 23.34,11.64 v28.34,6.64 | IC1.5 34.7,10.98 v33.94,11.74 33.64,11.44 33.64,8.04 34.43,7.25 C2.1
  Bottom 1.016: L2.2 27.53,5.83 v28.34,6.64 | C8.1 20.61,10.81 v21.44,11.64
N$11
  Bottom 0.61: L2.1 21.84,5.18 21.84,3.54 23.74,1.64 28.84,1.64 29.74,2.64 29.74,8.54 26.94,11.44 26.04,11.44 25.84,11.64 IC8.1
  Bottom 1.016: D6.A 20.86,8.32 20.94,8.24 20.94,6.08 L2.1
N$12
  Bottom 0.61: R2.1 11.83,13.73 13.84,15.74 14.91,15.74 C6.1 15.22,16.82 15.94,17.54 18.74,17.54 19.34,16.94 19.34,16.54 20.74,15.14 23.84,15.14 25.43,13.55 IC8.3
N$13  (via drill 0.6)
  Top 0.61: R3.1 39.84,8.42 v39.84,8.44
  Bottom 0.406: v39.84,8.44 39.2,9.08 IC1.3
N$14
  Top 0.406: 26.64,22.34 26.64,21.54 26.44,21.34
N$15  (via drill 0.6)
  Top 0.61: SW.2 43.66,10.21 44.84,9.04 v48.24,9.04
  Bottom 0.61: D4.A 31.46,7.82 33.74,5.14 37.74,5.14 38.74,4.24 39.84,4.24 41.25,4.65 44.84,8.64 45.35,8.64 R13.2 46.75,9.04 v48.24,9.04
N$17
  Top 0.305: IC3.17 38.08,26.47 C11.2
N$18
  Bottom 0.406: U$6.2 20.42,51.46 21.74,50.34 25.24,50.34 26.24,49.34 26.24,47.84 25.84,47.04 25.84,41.34 27.54,39.94 27.54,38.34 27.14,37.94 26.21,37.94 IC7.9
N$19
  Bottom 0.406: IC7.10 24.62,38.76 23.94,39.44 23.94,48.94 23.46,49.44 U$6.3
N$20
  Top 0.305: IC3.16 41.85,25.82 R9.1
N$21
  Top 0.61: K1.2 45,26.19 R9.2
N$22
  Top 0.61: K1.1 45.27,25.19 R6.2
N$23
  Top 0.305: IC3.15 41.86,25.17 R6.1
N$25  (via drill 0.6)
  Top 0.406: v40.14,39.44 40.14,37.66 U$6.11
  Bottom 0.406: IC7.24 39.46,38.76 v40.14,39.44
N$26
  Top 0.305: IC3.19 34.57,27.77 34.14,27.34 34.14,25.04 34.74,24.44 40.14,24.44 41.34,23.04 45.74,23.04 47.74,21.14 53.44,21.14 53.94,20.64 53.94,19.99 R4.2
  Top 0.61: 53.94,19.99 56.18,19.99 R8.1
N$27  (via drill 0.6)
  Top 0.406: v27.34,15.84 24.84,15.84 24.04,15.04 24.04,14.14 24.64,13.54 IC5.4
  Top 0.61: IC4.3 28.12,15.06 v27.34,15.84
  Bottom 0.406: IC8.4 29.46,13.64 30.14,13.64 30.64,14.14 30.64,14.84 29.64,15.84 27.44,15.84 v27.34,15.84
  Bottom 0.61: R12.2 26.55,16.63 v27.34,15.84
  Bottom 0.813: R12.2 26.65,16.63 27.44,15.84 29.94,15.84 31.34,14.44 31.14,14.44 30.94,14.24 31.34,14.24 31.44,14.34 31.44,13.32 D4.C
N$28  (via drill 0.6)
  Top 0.406: v28.04,36.54 25.84,36.54 25.44,37.04 25.44,38.44 24.84,39.04 22.94,39.04 21.64,37.84 21.64,34.44 21.24,33.94 19.44,33.94 18.74,34.64 18.74,36.94 16.34,39.34 16.34,43.74 16.46,43.86 17.76,43.86
  Top 0.61: C30.1 17.85,46.13 R18.2 17.76,43.86
  Bottom 0.406: IC7.34 35.99,30.89 35.74,31.14 33.14,31.14 31.84,32.44 29.94,32.44 29.34,33.04 29.34,35.24 v28.04,36.54
N$29
  Bottom 0.406: IC7.25 40.84,37.96 U$6.13
N$30  (via drill 0.6)
  Top 0.406: v37.84,48.34 37.14,48.34 35.34,50.24 25.04,50.24 23.04,48.24 v22.24,48.24
  Bottom 0.406: IC7.23 38.16,39.56 40.34,41.64 40.34,47.04 39.14,48.34 v37.84,48.34 | v22.24,48.24 22.24,39.36 U$6.9
N$31  (via drill 0.6)
  Top 0.406: v35.94,37.64 37.74,38.04 38.64,38.94 38.64,39.94 39.34,40.64 40.54,40.64 40.84,40.94 41.14,42.46 U$6.15
  Bottom 0.406: IC7.26 36.52,37.16 v35.94,37.64
N$33
  Top 0.406: 30.84,21.21 33.91,21.21 34.64,21.94 34.64,22.43 R14.1
  Top 0.813: IC4.1 30.84,21.21
N$34  (via drill 0.6)
  Top 0.406: 24.14,24.24 23.94,24.14 22.83,24.14 Q1.1 | v19.74,23.44 22.13,23.44 Q1.1 | v24.14,37.54 23.84,37.24 23.84,25.14 Q1.1
  Bottom 0.406: IC7.8 24.42,37.16 v24.14,37.54 | C25.2 19.78,23.48 v19.74,23.44
N$36
  Bottom 0.406: IC7.12 27.99,51.01 IC6.7
N$37
  Bottom 0.406: IC7.13 28.79,42.99 32.94,47.54 35.14,47.54 35.54,48.14 35.54,51.08 IC6.1
N$38  (via drill 0.6)
  Top 0.406: v36.94,51.14 36.84,53.44 v36.84,55.14
  Bottom 0.406: v36.84,55.14 35.14,55.14 34.24,55.64 IC6.15 | IC7.14 29.59,42.49 33.54,46.64 35.84,46.64 36.64,47.54 36.64,50.94 v36.94,51.14
N$39  (via drill 0.6)
  Top 0.61: v44.04,45.84 45.64,45.84 47.54,47.74 47.54,49.46 L3.1
  Bottom 0.406: IC7.27 39.62,36.36 41.74,34.24 43.24,34.24 44.04,35.04 v44.04,45.84
N$40  (via drill 0.6)
  Top 0.406: R17.1 38.15,33.7 R16.2 39.64,33.54 v40.14,33.54 | C27.2 53.62,39.22 v53.64,36.64 | v46.64,36.64 45.94,36.64 44.94,35.64 44.94,33.14 v42.94,31.14
  Bottom 0.406: IC7.29 38.92,34.76 v40.14,33.54 40.74,33.54 v42.94,31.14 | v46.64,36.64 v53.64,36.64
N$43  (via drill 0.6)
  Top 0.406: v22.74,36.64 22.74,26.94 21.54,25.84 14.88,25.84 Q1.2 14.02,23.14 v16.24,23.14
  Bottom 0.406: IC7.7 22.92,36.36 v22.74,36.64 | C23.2 16.2,23.18 v16.24,23.14
N$45  (via drill 0.6)
  Top 0.305: 27.54,31.64 28.23,31.64 IC3.4
  Top 0.406: v52.54,26.04 52.54,27.94 51.34,29.24 46.98,29.24 K1.5 | 25.75,28.83 R15.2 | 27.54,31.64 25.64,31.64 24.94,31.04 24.94,29.74 v25.94,28.74 | 40.21,44.44 C16.1 | R17.2 33.95,35.35 v33.64,35.24 32.84,34.24 32.84,32.24 33.24,31.84 33.24,29.34 34.15,28.42 IC3.20
  Top 0.61: 27.94,34.64 29.14,35.54 29.14,37.94 v28.64,38.24 | C4.1 14.96,11.04 | 35.84,58.64 v35.54,58.14 | 36.74,43.74 36.74,40.54 33.94,37.74 33.94,35.54 v33.64,35.24 | v31.84,42.94 31.84,43.44 31.94,43.54 | 31.94,43.54 32.14,43.74 | 40.21,44.44 37.94,44.44 36.24,43.44 35.04,43.44 34.04,44.34 32.74,44.34 31.94,43.54 | v25.94,28.74 25.84,28.74 25.75,28.83 25.04,29.54 25.04,33.61 IC7.5 27.92,34.76 v27.94,34.74
  Top 0.813: JP1.2 R11.2 2.24,27.54 | C29.1 8.98,40.18 8.74,39.94 | C15.1 8.95,37.73 8.74,37.94 | C18.1 30.66,57.26 32.04,58.64 | C17.1 26.8,40.08 v28.64,38.24 | 45.41,53.97 L3.2 | 44.54,54.44 v44.64,47.74 | v55.04,38.14 55.78,38.14 C13.1 57.14,39.02 57.14,27.24 55.94,26.04 v52.54,26.04
  Top 1.016: D5.C 14.73,10.39 C4.1 | C26.1 16.48,53.16 16.47,53.17 | 40.21,44.44 40.21,58.31 39.76,58.58 39.74,58.54
  Top 1.27: 5.33,21.64 5.33,19.75 7.54,17.54 7.54,14.14 10.34,11.34 11.58,11.34 R1.2 12.51,10.93 C4.1 | 5.33,21.64 5.33,25.44 | 5.33,25.44 JP1.2 | SJ1.2 5.9,21.64 5.33,21.64 | v17.54,28.94 12.64,28.94 8.94,25.24 5.53,25.24 5.33,25.44 | 43.94,55.24 43.94,56.64 42.04,58.54 39.34,58.54 39.24,58.64 | 43.94,55.24 44.54,54.44 | 45.41,53.97 45.21,53.97 43.94,55.24
  Top 1.422: 39.74,58.54 39.74,58.64 39.24,58.64 35.84,58.64 32.04,58.64 26.44,58.64 20.34,55.54 | 20.34,55.54 U$6.1 | 20.34,55.54 16.47,53.17 8.74,48.44 8.74,39.94 8.74,37.94 12.64,28.94
  Bottom 0.305: v25.94,28.74 25.74,28.74 25.54,28.94
  Bottom 0.406: IC7.38 32.79,26.79 33.54,26.04 v52.54,26.04 | U$6.1 C12.1 | IC7.5 26.61,34.74 v27.94,34.74 | IC7.17 31.99,42.79 v31.84,42.94 32.04,42.74 32.04,38.34 | 32.04,38.34 32.04,38.04 | 32.04,38.34 31.94,38.24
  Bottom 0.61: v35.54,58.14 IC6.16 | 19.94,28.94 17.54,28.84 | 31.94,38.24 31.54,38.24 | 31.54,38.24 v28.64,38.24 | v33.64,35.24 33.64,35.54 31.94,37.24 31.94,37.84 31.54,38.24
  Bottom 0.813: v17.54,28.94 17.64,28.94
  Bottom 1.016: v44.64,47.74 45.34,47.74 46.14,46.94 46.14,42.64 50.44,38.34 54.84,38.34 v55.04,38.14
  Bottom 1.27: v25.94,28.74 25.74,28.94 19.94,28.94 17.64,28.94
OLED_RST  (via drill 0.6)
  Top 0.406: v34.04,39.74 32.14,37.24 32.14,24.44 32.84,23.84 39.34,23.84 41.14,22.04 45.54,22.04 48.14,19.44 48.14,17.11 JP2.9
  Bottom 0.406: v34.04,39.74 34.64,39.74 35.14,40.34 35.14,41.31 IC7.21
OLED_RX
  Bottom 0.406: IC6.5 30.43,52.63 31.34,53.54 37.14,53.54 40.24,56.34 44.04,56.34 45.84,54.54 45.84,50.94 47.84,48.94 53.84,47.24 56.04,44.94 56.04,43.34 58.24,40.64 58.34,22.24 57.04,18.14 56.54,16.84 54.34,14.34 53.54,12.24 52.74,10.94 49.94,10.94 46.54,14.34 42.54,14.34 41.72,15.16 JP2.5
OLED_TX  (via drill 0.6)
  Top 0.406: v49.44,13.24 49.14,12.54 v48.24,10.64
  Bottom 0.406: IC6.2 34.24,52.24 34.64,52.64 37.74,52.64 40.54,55.44 43.54,55.44 44.74,54.24 44.74,50.54 47.44,47.84 53.04,46.34 55.14,44.24 55.14,42.34 57.24,40.24 57.34,22.14 55.54,17.04 53.54,14.84 52.84,13.04 52.24,11.84 50.44,11.84 v49.44,13.24 | v48.24,10.64 47.54,11.74 45.94,13.54 40.14,13.54 39.18,14.5 JP2.3
ONOFF  (via drill 0.6)
  Top 0.406: v33.34,42.94 33.34,41.44 31.44,38.44 31.44,23.64 31.53,23.64 R14.2
  Bottom 0.406: IC7.19 33.59,42.89 v33.34,42.94
ST  (via drill 0.6)
  Top 0.61: v46.54,34.94 46.54,34.58 K1.10
  Bottom 0.406: IC7.40 31.19,25.99 34.74,21.84 51.14,21.84 52.94,24.24 55.34,26.64 55.34,32.54 52.84,35.04 46.64,35.04 v46.54,34.94
SWITCH  (via drill 0.6)
  Top 0.406: R5.2 26.13,19.14 v28.44,19.14 29.54,20.24 v29.54,24.14
  Bottom 0.406: R13.1 44.96,10.52 42.74,12.74 38.34,12.74 37.64,13.44 35.34,13.44 34.74,14.04 34.74,15.44 33.74,16.54 31.04,16.54 v28.44,19.14 | IC7.42 29.59,24.19 v29.54,24.14
  Bottom 0.813: C28.1 28.38,19.2 v28.44,19.14
USB_CONNECT  (via drill 0.6)
  Top 0.305: IC3.14 26.68,25.17 R15.1
  Top 0.406: v27.44,23.84 27.44,24.42 R15.1
  Bottom 0.406: IC7.41 30.39,25.19 31.04,24.54 31.04,23.54 30.44,22.94 28.34,22.94 v27.44,23.84
VBAT_CHECK  (via drill 0.6)
  Top 0.406: v46.44,38.44 46.44,39.86 R10.2
  Top 0.61: R10.2 48.56,39.97 R7.1
  Bottom 0.406: IC7.33 38.92,31.56 40.04,29.74 43.94,29.74 44.94,30.74 44.94,37.54 v46.44,38.44
VBUS  (via drill 0.6)
  Top 0.61: K1.3 49.39,27.19 54.54,22.04 57.24,22.04 58.14,20.94 58.14,18.94 57.37,17.97 R8.2 56.3,17 53.94,14.44 42.44,14.44 v39.64,11.64
  Bottom 0.406: IC1.1 37.97,11.04 39.84,11.04 40.17,11.37 C1.1
  Bottom 0.61: v39.64,11.64 41.26,11.64 C1.1
X  (via drill 0.6)
  Top 0.406: v54.34,30.14 54.34,30.64 53.44,31.14 46.98,31.14 K1.7
  Bottom 0.406: IC7.37 33.59,27.29 34.04,26.84 51.14,26.84 v54.34,30.14
XBEE_RSSI
  Top 0.61: R18.1 18.14,41.86 U$6.6
XBEE_RST  (via drill 0.6)
  Top 0.406: U$6.5 20.36,45.46 24.04,47.44 33.84,47.44 v35.84,45.64
  Bottom 0.406: v35.84,45.64 35.24,43.14 34.44,42.34 34.44,41.41 IC7.20
Y  (via drill 0.6)
  Top 0.406: v52.14,32.64 51.64,32.14 46.98,32.14 K1.8
  Bottom 0.406: IC7.36 34.39,27.99 34.74,27.64 50.34,27.64 52.14,29.44 v52.14,32.64
Z  (via drill 0.6)
  Top 0.406: v49.94,34.04 49.94,33.74 49.44,33.24 46.98,33.24 K1.9
  Bottom 0.406: IC7.35 35.19,28.49 35.24,28.44 48.74,28.44 50.24,29.94 50.24,33.74 v49.94,34.04

### Text on the board
_tsilk: 1 | OLED | 1 | batt